# Altium schematic sheet PWR_Supply_With_BUCK_Converter.SchDoc
size A4; SheetNumber: 1; SheetTotal: 1
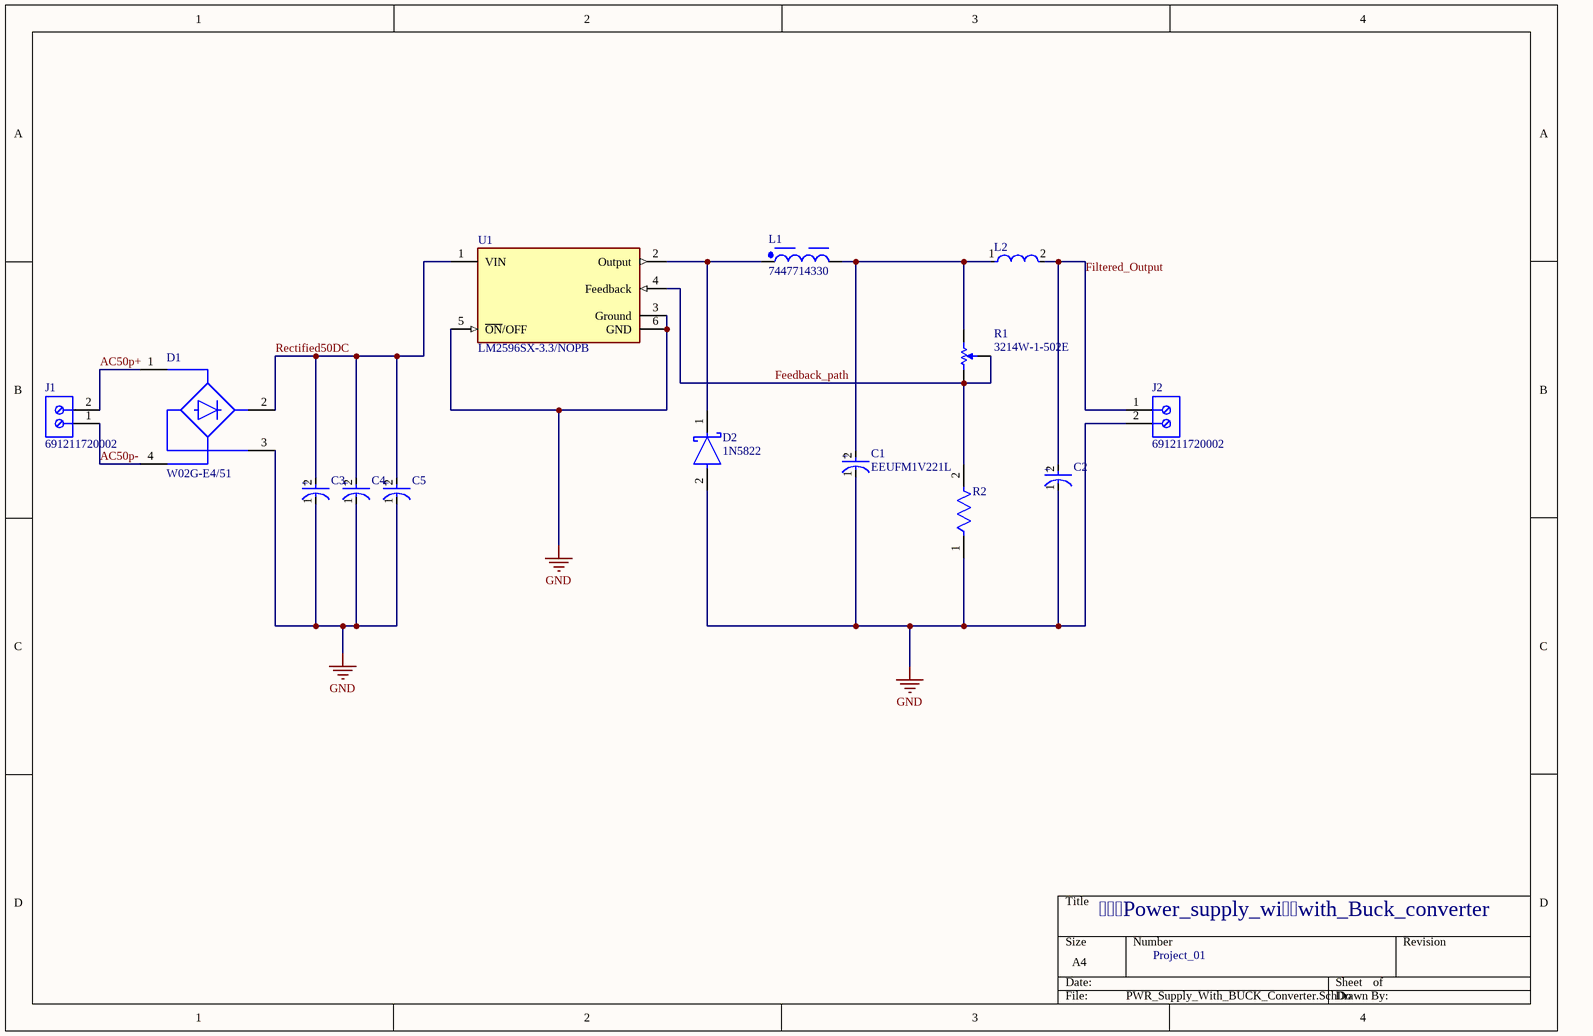
[diagram p0: PWR_Supply_With_BUCK_Converter.SchDoc]

## Parts
C1  EEUFM1V221L  [FP-RAD-TH-D_8_0_5-L_15_1-MFG]
C2  EEUFR1H101  [FP-RAD-TH-D_8_0_5-L_11_5-MFG]  (value not drawn)
C3  EEUFK0J102L  [FP-RAD-TH-D_8_0_5-L_15_1-MFG]  (value not drawn)
C4  EEUFK0J102L  [FP-RAD-TH-D_8_0_5-L_15_1-MFG]  (value not drawn)
C5  EEUFR1H101  [FP-RAD-TH-D_8_0_5-L_11_5-MFG]  (value not drawn)
D1  W02G-E4/51  [FP-WOG-MFG]
D2  1N5822  [FP-DO-201AD-MFG]
J1  691211720002  [691211720002]
J2  691211720002  [691211720002]
L1  7447714330  [WE-PD_1050P]
L2  IHLP2525CZER220M11  [FP-IHLP-2525CZ-FP_2_413x3-MFG]  (value not drawn)
R1  3214W-1-502E  [BOUR-3214W_V]
R2  MCA12060D5000BP500  [FP-MCA1206-IPC_C]  (value not drawn)
U1  LM2596SX-3.3/NOPB  [FP-KTT0005B-MFG]

## Nets
GND: C1.1(C) C2.1(C) C3.1(C) C4.1(C) C5.1(C) D1.3(-) D2.2(A) J2.2 R2.1 U1.3(Ground) U1.5(~{ON}/OFF) U1.6(GND)
AC50p+: D1.1(1_~) J1.2
AC50p-: D1.4(2_~) J1.1
Feedback_path: R1.1 R1.2 R2.2 U1.4(Feedback)
Filtered_Output: C2.2(A) J2.1 L2.2
Rectified50DC: C3.2(A) C4.2(A) C5.2(A) D1.2(+) U1.1(VIN)
NetC1_2: C1.2(A) L1.2 L2.1 R1.3
NetD2_1: D2.1(C) L1.1 U1.2(Output)

## Notes on the sheet
- Power_supply_wiwith_Buck_converter
- Project_01
- (in symbol CMP-05427-000678-1) +
- (in symbol CMP-05427-000688-1) +
- (in symbol CMP-05427-002079-1) +

## Library data of the parts
C1 = CMP-05427-000678-1: Aluminum Electrolytic Capacitors (Radial Lead Type) 220uF ±20% 35V; Ripple Current: 1.24A; Impedance: 41mR; Lead Length: 17mm; Life (Hours): 3000Hour; Lead Diameter: 0.6mm; Dielectric Material: Aluminium; Dissipation Factor: 0.12%; Package Quantity: 200; Tolerance: 20%; Series: FM; Voltage Rating: 35V; Lead Pitch: 3.5mm; Radiation Hardening: No; Construction: RADIAL; RoHS Compliant: Yes; REACH SVHC: Yes; Lead Free: Lead Free; Height - Seated (Max): 0.65inch; Length: 15mm; Diameter: 8mm; Mount: Through Hole; Number of Pins: 2; Height: 15mm; Voltage: 35V; Case/Package: Radial; Packaging: Bulk; Min Operating Temperature: -40°C; Voltage Rating (DC): 35V; ESR (Equivalent Series Resistance): 41mR; Capacitance: 220uF; Max Operating Temperature: 105°C; Termination: Radial
C2 C5 = CMP-05427-002079-1: Aluminum Electrolytic Capacitors (Radial Lead Type) 100uF ±20% 50V; ESR (Equivalent Series Resistance): 61mR; Lead Diameter: 0.6mm; Ripple Current (AC): 870mA; Life (Hours): 6000Hour; Lead/Base Style: Straight; Height - Seated (Max): 0.512inch; Height: 11.5mm; REACH SVHC: No SVHC; Contact Plating: Tin; Impedance: 61mR; Capacitance: 100uF; Voltage: 50V; Termination: Radial; Series: FR; Voltage Rating: 50V; Lead Pitch: 3.5mm; Diameter: 8mm; Number of Pins: 2; Min Operating Temperature: -40°C; Mount: Through Hole; Ripple Current: 870mA; Radiation Hardening: No; Length: 11.5mm; Max Operating Temperature: 105°C; Construction: RADIAL; Packaging: Bulk; Package Quantity: 200; Case/Package: Radial; RoHS Compliant: Yes; Voltage Rating (DC): 50V; Tolerance: 20%
C3 C4 = CMP-05427-000688-1: Aluminum Electrolytic Capacitors (Radial Lead Type) AEC-Q200 Qualified 1000uF ±20% 6.3V; Capacitance: 1mF; Dielectric Material: Aluminium; Impedance: 62mR; Life (Hours): 3000Hour; Ripple Current: 860mA; Lead Diameter: 0.6mm; Construction: RADIAL; Number of Pins: 2; Voltage: 6.3V; Termination: Radial; Radiation Hardening: No; Case/Package: Radial; Voltage Rating: 6.3V; Packaging: Bulk; Height: 15mm; Voltage Rating (DC): 6.3V; Min Operating Temperature: -55°C; Diameter: 8mm; Length: 0inch; Lead Pitch: 3.5mm; Series: FK Radial; Contact Plating: Tin; REACH SVHC: No SVHC; Max Operating Temperature: 105°C; RoHS Compliant: Yes; Tolerance: 20%; Mount: Through Hole; Width: 0inch
D1 = CMP-02540-000101-1: BRIDGE RECT 1PHASE 200V 1.5A WOG; Max Surge Current: 50A; Max Reverse Current: 5uA; Element Configuration: Single; Capacitance: 14pF; Forward Voltage: 1V; Number of Elements: 1; RoHS Compliant: Yes; Number of Pins: 4; Packaging: Bulk; Series: -; Radiation Hardening: No; Diameter: 9mm; Width: 8.84mm; Min Operating Temperature: -55°C; Peak Non-Repetitive Surge Current: 50A; Output Current: 1.5A; Average Rectified Current: 1.5A; Mount: Through Hole; Length: 9.86mm; Forward Current: 1.5A; Lead Free: Lead Free; Max Forward Surge Current (Ifsm): 50A; Package Quantity: 3000; Max Repetitive Reverse Voltage (Vrrm): 200V; Max Reverse Leakage Current: 5uA; Max Operating Temperature: 150°C; Height: 5.6mm
D2 = CMP-12187-000025-1: DIODE SCHOTTKY 40V 3A DO201AD; Manufacturer: STMicroelectronics; Max Junction Temp: +150°C; Peak Reverse Current: 2mA; Max Surge Forward Current: 80A; Temperature Range High: +150°C; Automotive: No; RoHS: TRUE; ComponentLink2Description: Datasheet; Manufacturer Part Number: 1N5822; Lead Free: Yes; Octopart: https://octopart.com/1n5822-stmicroelectronics-323225; Device Class L2: Diodes; Max Repetitive Reverse Voltage: 40V; Temperature: to +150°C; Height: 5.3mm; Category: Diode; Digikey Description: DIODE SCHOTTKY 40V 3A DO201AD; ComponentLink2URL: https://www.st.com/resource/en/datasheet/1n5822.pdf; Device Class L3: Schottky Diodes; Device Class L1: Discrete Semiconductors; Forward Current: 3A; Mouser Description: Schottky Diodes & Rectifiers Vr/40V Io/3A BULK; Package: DO-201AD
J1 J2 = CMP-1502-02524-2: NexarPartId: 8917714; Number of Positions Per Level: 2; Wire Gauge (Min): 12AWG; Voltage: 300V; Connector Type: PCB, Terminal Block; Pitch: 5.0038mm; Current: 10A; Number of Levels: 1; Wire Gauge (Max): 24AWG; Plating: Brass, Steel; Stripping Length: -7mm; Width: 10mm; Min Operating Temperature: -40°C; Mount: Through Hole; Lead Pitch: 5mm; Max Operating Temperature: 105°C; Packaging: Box; Number of Contacts: 2; Length: 13.7mm; Height: 15.5mm; Color: Green; Number of Pins: 2; Wire/Cable Gauge: 12AWG; Housing Material: Nylon; REACH SVHC: Unknown; Contact Plating: Tin; RoHS: Compliant; Contact Material: Brass; Termination: Screw
L1 = CMP-1396-00022-2: NexarPartId: 22866944; Tolerance: 20%; Saturation Current: 2.9A; Resistance: 79mΩ; DC Resistance (DCR): 66mΩ; Shielding: Shielded; RMS Current (Irms): 2.5A; Test Frequency: 100kHz; Self Resonant Frequency: 11.1MHz; Inductance: 33µH; Core Material: Ferrite; Number of Pins: 2; Height: 5mm; Width: 10mm; Min Operating Temperature: -40°C; Inductance Tolerance: 20%; Termination: SMD/SMT; Depth: 10mm; Packaging: Cut Tape (CT); Ambient Temperature Range High: 110°C; Height - Seated (Max): 5.0038mm; Composition: Wirewound; Max Operating Temperature: 150°C; Max DC Current: 2.5A; REACH SVHC: Unknown; Current Rating: 2.5A; Series Resistance: 79mΩ; Case/Package: Nonstandard; Ambient Temperature Range Low: -40°C; RoHS: Compliant; Length: 10mm; Mount: Surface Mount
L2 = CMP-2000-06442-2: Commercial Inductors, Low DCR Series 22uH 2.9A 135mΩ 20%; Self Resonant Frequency: 1MHz; Shielding: Shielded; Core Material: Ferrite; DC Resistance (DCR): 135mR; Test Frequency: 100kHz; Saturation Current: 2.5A; Case/Package: 2525; Inductance Tolerance: 20%; Max DC Current: 2.9A; Inductance: 22uH; Termination: SMD/SMT; Case Code (Imperial): 2525; Mount: Surface Mount; Military Standard: Not; Min Operating Temperature: -55°C; RMS Current (Irms): 2.9A; Package Quantity: 2000; Max Operating Temperature: 125°C; Length: 7.24mm; Depth: 6.72mm; Packaging: Tape and Reel; Height: 3mm; Width: 0.255inch; Lead Free: Lead Free; Tolerance: 20%; Contact Plating: Tin; Current Rating: 2.9A; Number of Pins: 2; Case Code (Metric): 6363; Radiation Hardening: No; Height - Seated (Max): 0.118inch
R1 = CMP-2000-05579-1: 3214 - 5-Turn Trimpot(R) Trimming Potentiometer, 5 KOhm, +/- 10%, 0.25 W, -65 to 150 degC, RoHS, Tape and Reel; Manufacturer: Bourns; Temperature Coefficient: ±100ppm/°C; Power Rating: 250mW; No. of Turns: 5; Track Resistance: 5kohm; SVHC: NoSVHC(16-Jun-2014); Potentiometer Mounting: SMD; Manufacturer URL: http://www.bourns.com/; Resistance Tolerance: ±10%; Datasheet URL: http://www.bourns.com/docs/Product-Datasheets/3214.pdf; ROHS COMPLIANT: Yes; Mounting Technology: SurfaceMount; Datasheet Version: 05/2016; Package Reference: 3214W; Package Description: 3-Pin Surface Mount Device, Body 3.5 x 4.8 mm, Pitch 1.25 mm
R2 = CMP-02407-005036-1: Res MC Precision Thin Film 1206 500Ω 0.1% 0.25W ±25ppm/°C Molded Paper T/R; Max Power Dissipation: 250mW; Resistance: 500R; Min Operating Temperature: -55°C; Length: 0.126inch; Packaging: Tape and Reel; Composition: Thin Film; Width: 0.063inch; Height: 0.026inch; Package Quantity: 5000; Number of Terminations: 2; Lead Free: Lead Free; Temperature Coefficient: 25ppm/°C; Case/Package: 1206; Max Operating Temperature: 125°C; Tolerance: 0.1%; Depth: 1.6mm; Military Standard: Not
U1 = CMP-04918-000394-1: IC REG BUCK 3.3V 3A TO263-5; Synchronous Rectifier: No; Output Configuration: Positive; Min Supply Voltage: 4.5V; Operating Supply Voltage: 40V; Output Type: Fixed; Switching Frequency: 173kHz; Quiescent Current: 5mA; Efficiency: 73%; Number of Outputs: 1; Output Voltage: 3.3V; Lead Free: Contains Lead; Max Output Current: 3A; Packaging: Cut Tape; Case/Package: TO-263-5; RoHS Compliant: Yes; Output Current: 3A; Series: LM2596; Min Input Voltage: 4.5V; Min Operating Temperature: -40°C; Number of Pins: 5; REACH SVHC: No SVHC; Min Output Voltage: 3.3V; Radiation Hardening: No; Weight: 0.056128oz; Max Input Voltage: 40V; Nominal Output Voltage: 3.3V; Package Quantity: 500; Mount: Surface Mount; Operating Supply Current: 5mA; Max Operating Temperature: 125°C